# EAGLE schematic ir_board (EAGLE 6.5.0)
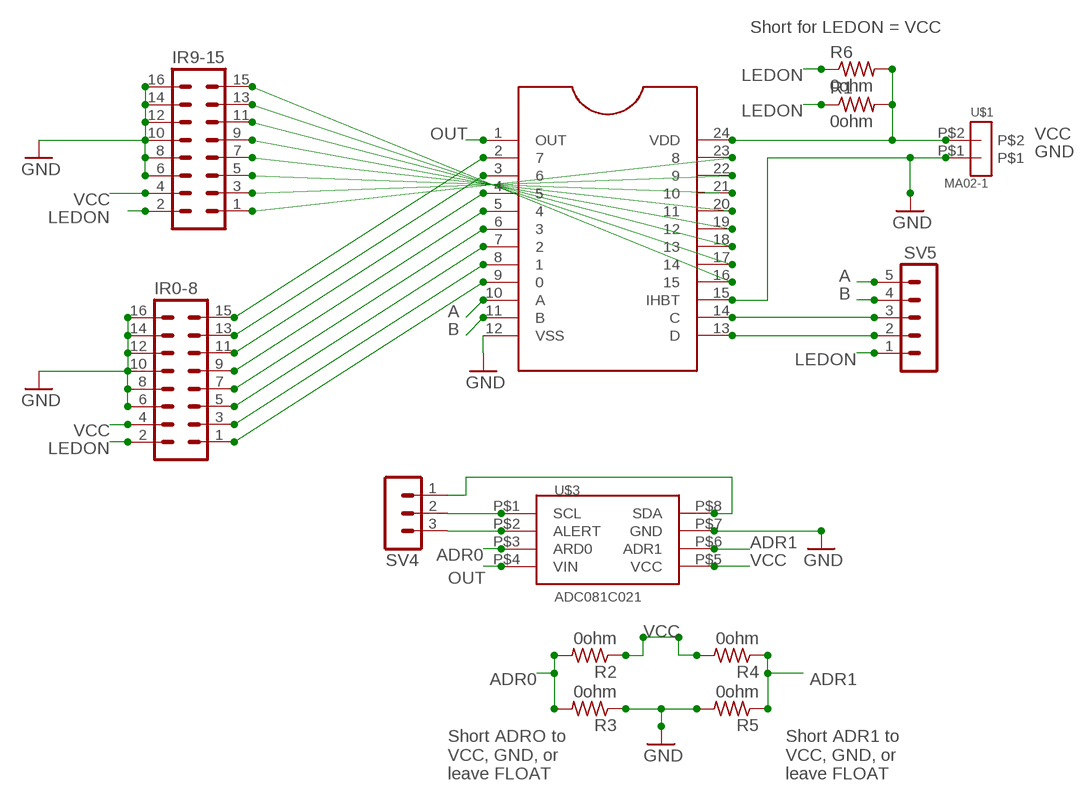
[diagram p0: schematic, sheet 1]

## Parts
IR0-8  MA08-2  [MA08-2]
IR9-15  MA08-2  [MA08-2]
R1  0ohm  R-US_R0805  [R0805]
R2  0ohm  R-US_R0805  [R0805]
R3  0ohm  R-US_R0805  [R0805]
R4  0ohm  R-US_R0805  [R0805]
R5  0ohm  R-US_R0805  [R0805]
R6  0ohm  R-US_R0805  [R0805]
SV4  MA03-1  [MA03-1]
SV5  MA05-1  [MA05-1]
U$1  MA02-1  [MA02-1]
U$2  16BIT_ANALOG_MUX  [DIL24-6]
U$3  ADC081C021  [TSSOP-8]

## Nets
A: SV5.5 U$2.10(A)
ADR0: R2.2 R3.2 U$3.P$3(ARD0)
ADR1: R4.1 R5.1 U$3.P$6(ADR1)
ALERT: SV4.3 U$3.P$2(ALERT)
B: SV5.4 U$2.11(B)
GND [power]: IR0-8.6 IR0-8.8 IR0-8.10 IR0-8.12 IR0-8.14 IR0-8.16 IR9-15.6 IR9-15.8 IR9-15.10 IR9-15.12 IR9-15.14 IR9-15.16 R3.1 R5.2 U$1.P$1 U$2.12(VSS) U$2.15(IHBT) U$3.P$7(GND)
LEDON: IR0-8.2 IR9-15.2 R1.1 R6.1 SV5.1
N$1: IR0-8.1 U$2.9
N$2: IR0-8.3 U$2.8
N$3: IR0-8.5 U$2.7
N$4: IR0-8.7 U$2.6
N$5: IR0-8.9 U$2.5
N$6: IR0-8.11 U$2.4
N$7: IR0-8.13 U$2.3
N$8: IR0-8.15 U$2.2
N$9: IR9-15.1 U$2.23
N$10: IR9-15.3 U$2.22
N$11: IR9-15.5 U$2.21
N$12: IR9-15.7 U$2.20
N$13: IR9-15.9 U$2.19
N$14: IR9-15.11 U$2.18
N$15: IR9-15.13 U$2.17
N$16: IR9-15.15 U$2.16
N$17: SV5.2 U$2.13(D)
N$18: SV5.3 U$2.14(C)
OUT: U$2.1(OUT) U$3.P$4(VIN)
SCL: SV4.2 U$3.P$1(SCL)
SDA: SV4.1 U$3.P$8(SDA)
VCC [power]: IR0-8.4 IR9-15.4 R1.2 R2.1 R4.2 R6.2 U$1.P$2 U$2.24(VDD) U$3.P$5(VCC)

## Notes on the sheet
- Short for LEDON = VCC
- Short ADRO to
  VCC, GND, or
  leave FLOAT
- Short ADR1 to
  VCC, GND, or
  leave FLOAT

## Library data of the parts
IR0-8 IR9-15 = con-lstb:MA08-2: PIN HEADER; OC_FARNELL: unknown; OC_NEWARK: unknown
R1-R6 = rcl:R-US_: RESISTOR, American symbol
SV4 = con-lstb:MA03-1: PIN HEADER; OC_FARNELL: unknown; OC_NEWARK: unknown
SV5 = con-lstb:MA05-1: PIN HEADER; OC_FARNELL: unknown; OC_NEWARK: unknown
U$1 = IEEE_bot_specific_parts:MA02-1
U$2 = IEEE_bot_specific_parts:16BIT_ANALOG_MUX: CD4067B 16Bit Analog Mux http://www.ti.com/lit/ds/symlink/cd4067b.pdf
U$3 = IEEE_bot_specific_parts:ADC081C021

## Net classes
0 default: width 0.203 mm, drill 0.152 mm, clearance 0.254 mm
1 power: width 0.254 mm, drill 0.203 mm, clearance 0.305 mm